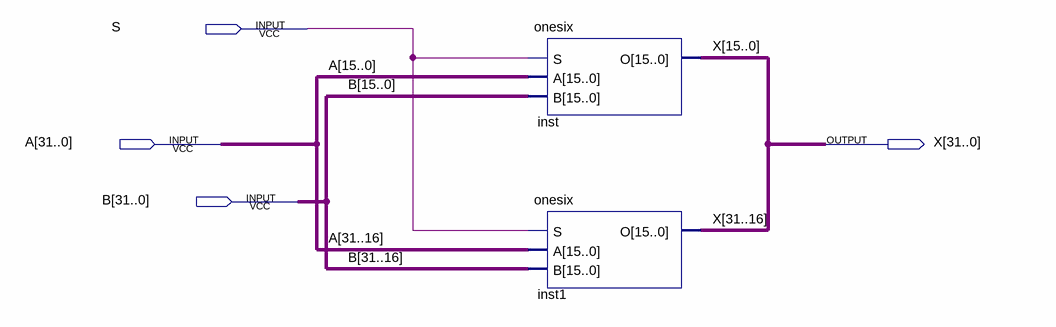
[diagram p0: schematic sheet]
// Quartus schematic threetwo.bdf as structural Verilog: 2 symbols, 4 pins
module threetwo (
  input  S,
  input  [31:0] A,
  input  [31:0] B,
  output [31:0] X
);

  onesix inst (.S(S), .A(A[15:0]), .B(B[15:0]), .O(X[15:0]));
  onesix inst1 (.S(S), .A(A[31:16]), .B(B[31:16]), .O(X[31:16]));
endmodule
